# Altium project Power Board.PrjPcb
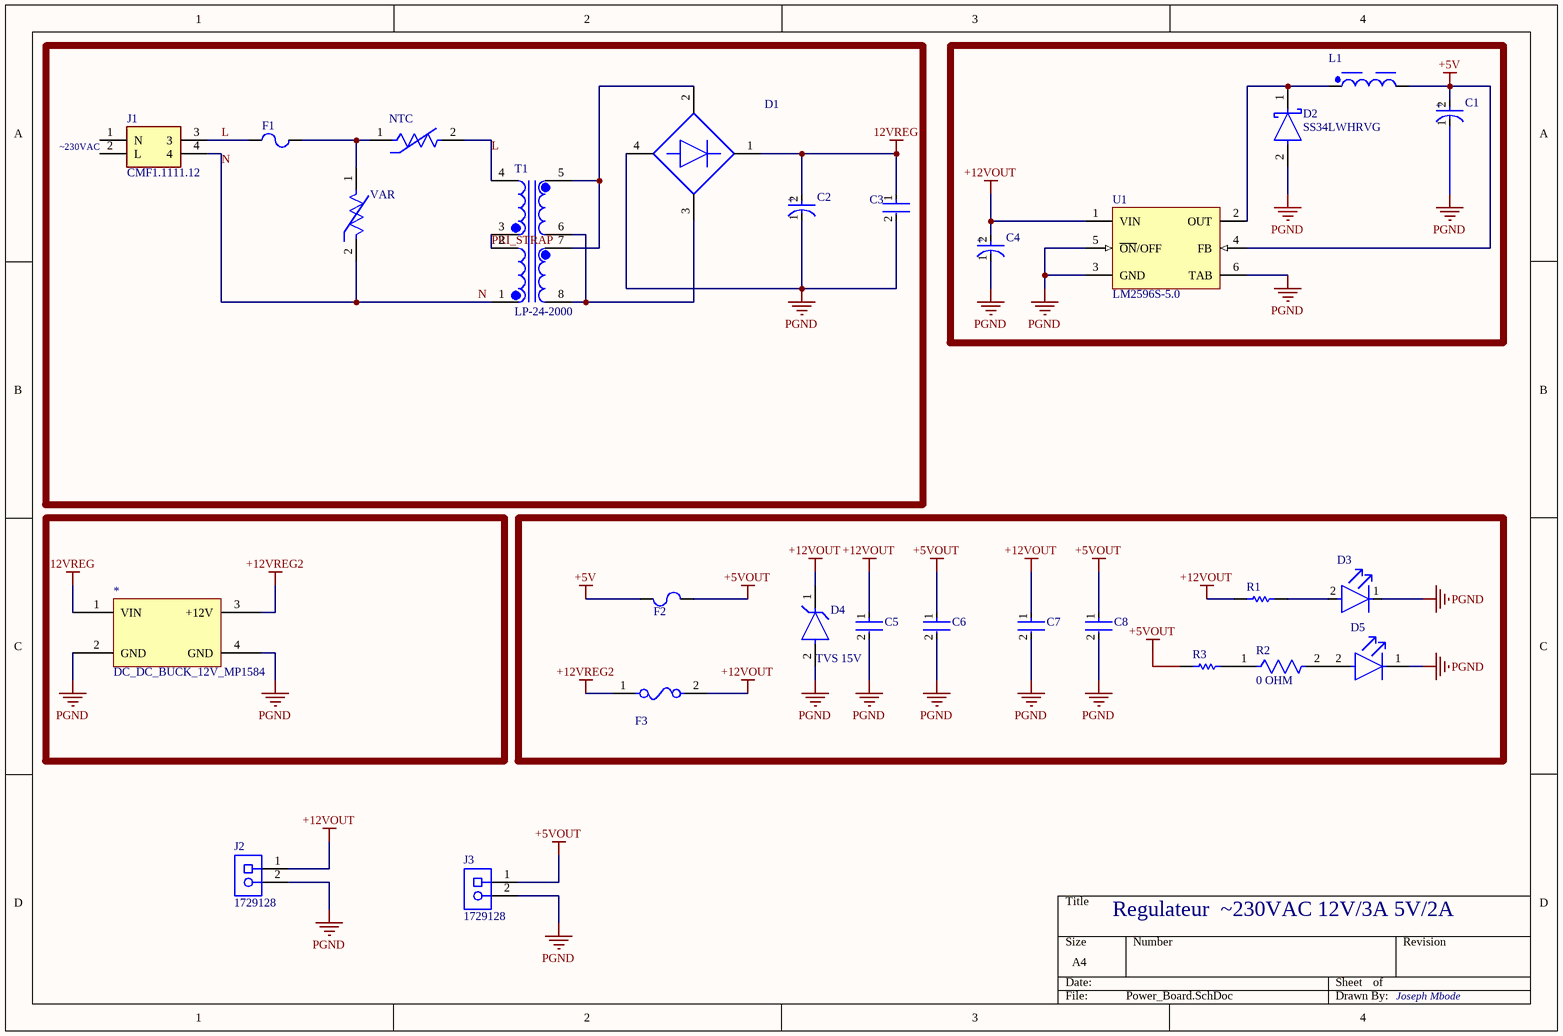
[diagram p0: Power_Board.SchDoc]
1 sheet, 28 parts. Net scope: global (net labels, ports and power ports of the same name join across sheets).
Board file: Power_Board.PcbDoc

## Sheet Power_Board.SchDoc
size A4; SheetNumber: 1; SheetTotal: 1

### Parts
*  DC_DC_BUCK_12V_MP1584  [DC_DC_BUCK_12V_MP1584]
C1  EEVTG1H221Q  [FP-TGH13-MFG]  (value not drawn)
C2  ECA1VHG472  [FP-RAD-TH-D_18_0_5-L_35_5-MFG]  (value not drawn)
C3  RHEL81H155K2A2H03B  [FP-RHE2DB-MFG]  (value not drawn)
C4  EEUFR1E221  [FP-RAD-TH-D_8_0_5-L_11_5-MFG]  (value not drawn)
C5  AC1206KKX7R0BB104  [FP-AC1206-0_85-MFG]  (value not drawn)
C6  AC1206KKX7R0BB104  [FP-AC1206-0_85-MFG]  (value not drawn)
C7  AC1206KKX7R0BB104  [FP-AC1206-0_85-MFG]  (value not drawn)
C8  AC1206KKX7R0BB104  [FP-AC1206-0_85-MFG]  (value not drawn)
D1  GBU4M-E3/51  [FP-GBU4M-E3-51-MFG]  (value not drawn)
D2  SS34LWHRVG  [FP-SS34LWH-MFG]
D3  XLUR12D  [FP-XLUR12D-MFG]  (value not drawn)
D4  TVS 15V  [FP-DO-15-MFG]
D5  SSL-LX5093YD  [FP-SSL-LX5093YD-MFG]  (value not drawn)
F1  021502.5MXP  [LFUS-0215-20X5_L]  (value not drawn)
F2  1812L150ZR  [LFUS-FUSE1812-71_V]  (value not drawn)
F3  0452004.MRL  [FP-0452-MFG]  (value not drawn)
J1  CMF1.1111.12  [CMF1111112]
J2  1729128  [PHOE-1729128-2_V]
J3  1729128  [PHOE-1729128-2_V]
L1  7447471330  [WE-TIS_1111]  (value not drawn)
NTC  NTPAA100LDNB0  [FP-NTPAA-MFG]  (value not drawn)
R1  3R3 5% 0805(2012)  [RESC0805(2012)_M]  (value not drawn)
R2  0 OHM  [FP-CRG0402-IPC_C]
R3  3R3 5% 0805(2012)  [RESC0805(2012)_M]  (value not drawn)
T1  LP-24-2000  [XFMR_LP-24-2000]
U1  LM2596S-5.0  [KTT0005B_L]
VAR  IsoM5-275-B-L2  [FP-IsoM5-275-B-L2-MFG]  (value not drawn)

### Blocks framed on the sheet
~230VAC: C2 C3 D1 F1 J1 NTC T1 VAR

### Nets
12VREG: *.1(VIN) C2.2(A) C3.1 D1.1(+)
+5V: C1.2(A) F2.1 L1.2 U1.4(FB)
+5VOUT: C6.1 C8.1 F2.2 J3.1 R3.1
+12VOUT: C4.2(A) C5.1 C7.1 D4.1(C) F3.2 J2.1 R1.1 U1.1(VIN)
+12VREG2: *.3(+12V) F3.1
PGND: *.2(GND) *.4(GND) C1.1(C) C2.1(C) C3.2 C4.1(C) C5.2 C6.2 C7.2 C8.2 D1.4(-) D2.2(A) D3.1(C) D4.2(A) D5.1(C) J2.2 J3.2 U1.3(GND) U1.5(~{ON}/OFF) U1.6(TAB)
L: F1.1 J1.3 NTC.2 T1.4
N: J1.4 T1.1 VAR.2
PRI_STRAP: T1.2 T1.3
NetD1_2: D1.2(1_~) T1.5 T1.7
NetD1_3: D1.3(2_~) T1.6 T1.8
NetD2_1: D2.1(C) L1.1 U1.2(OUT)
NetD3_2: D3.2(A) R1.2
NetD5_2: D5.2(A) R2.2
NetF1_2: F1.2 NTC.1 VAR.1
NetR2_1: R2.1 R3.2

Not connected (* = marked no-connect by the designer): J1 1(N) 2(L)

### Notes on the sheet
- Regulateur  ~230VAC 12V/3A 5V/2A
- Joseph Mbode
- (in symbol CMP-05427-000003-1) +
- (in symbol CMP-05427-000847-1) +
- (in symbol CMP-05427-001627-1) +

### Library data of the parts
C1 = CMP-05427-000003-1: CAP ALUM 220UF 20% 50V SMD; Manufacturer: Panasonic Electronic Components; Life: 1000Hours; Material: Aluminum; Esr: 0.23Ω; Ripple Current: 600mA; Leakage Current: 1.1mA; Dissipation Factor: 14%; Automotive Grade: Grade 1; RoHS: TRUE; Digikey Description: CAP ALUM 220UF 20% 50V SMD; Package: TGH13; ComponentLink2URL: https://industrial.panasonic.com/cdbs/www-data/pdf/RDE0000/ABA0000C1187.pdf; Height: 14mm; Temperature: -40°C to +125°C; Tolerance: 20%; Temperature Range High: +125°C; Capacitance: 220uF; Temperature Range Low: -40°C; Device Class L1: Passive Components; Voltage Rating: 50V; Device Class L2: Capacitors; Category: Cap; Value: 220uF; Manufacturer Part Number: EEVTG1H221Q; Footprint Url: https://industrial.panasonic.com/cdbs/www-data/pdf/RDE0000/DME0000COL48.pdf; Octopart: https://octopart.com/eev-tg1h221q-panasonic-39480853; ComponentLink2Description: Datasheet; Automotive: Yes; Device Class L3: Aluminum Electrolytic Capacitors; Mouser Description: Aluminum Electrolytic Capacitors - SMD 220UF 50V TG SMD; Lead Free: Yes
C2 = CMP-05427-001627-1: Aluminum Electrolytic Capacitors (Radial Lead Type) AEC-Q200 Qualified 4700uF ±20% 35V; Leakage Current: 3uA; Life (Hours): 2000Hour; Lead Diameter: 0.8mm; Dissipation Factor: 0.2%; Lead/Base Style: Straight; Ripple Current: 1.91A; Capacitance: 4.7mF; Packaging: Bulk; RoHS Compliant: Yes; Number of Pins: 2; Radiation Hardening: No; Features: General Purpose; Mount: Through Hole; Voltage Rating (DC): 35V; Construction: RADIAL; Min Operating Temperature: -55°C; Voltage Rating: 35V; Contact Plating: Tin; Height - Seated (Max): 1.398inch; Termination: Radial; Series: NHG; Lead Pitch: 7.5mm; Diameter: 18mm; Voltage: 35V; Package Quantity: 50; Height: 35.5mm; Max Operating Temperature: 105°C; REACH SVHC: No SVHC; Length: 35.5mm; Case/Package: Radial; Tolerance: 20%; Ripple Current (AC): 1.91A
C3 = CMP-06035-050647-1: Ceramic Capacitor Automotive 1.5uF ±10% 50V X8L Radial; Tolerance: 10%; REACH SVHC: No SVHC; Min Operating Temperature: -55°C; Max Operating Temperature: 150°C; Voltage Rating (DC): 50V; Dielectric: X8L; Lead Pitch: 2.5mm; Voltage Rating: 50V; Capacitance: 1.5uF
C4 = CMP-05427-000847-1: Aluminum Electrolytic Capacitors (Radial Lead Type) 220uF ±20% 25V; Impedance: 56mR; Ripple Current (AC): 950mA; Lead Diameter: 0.6mm; Life (Hours): 6000Hour; Max Operating Temperature: 105°C; Height: 11.5mm; Min Operating Temperature: -40°C; Series: FR Radial; Voltage Rating (DC): 25V; RoHS Compliant: Yes; Voltage Rating: 25V; Diameter: 8mm; Ripple Current: 950mA; Contact Plating: Tin; Case/Package: Radial; Lead Pitch: 3.5mm; Termination: Radial; Capacitance: 220uF; Construction: RADIAL; Voltage: 25V; Tolerance: 20%; REACH SVHC: Yes; Mount: Through Hole
C5-C8 = CMP-03422-001145-1: CAP CER 0.1UF 100V X7R 1206; Manufacturer: Yageo; Material: Ceramic; Temperature Coefficient: 15%; Tolerance: 0.1; Automotive Grade: Grade 1; Value: 100 nF; Category: Cap; Temperature Characteristic: X7R; Height: 0.95mm; Automotive: Yes; Digikey Description: CAP CER 0.1UF 100V X7R 1206; Voltage Rating: 100 V; Octopart: https://octopart.com/ac1206kkx7r0bb104-yageo-75666120; ComponentLink2URL: http://www.yageo.com/documents/recent/UPY-AC_NP0X7R_16V-to-630V_12.pdf; Device Class L1: Passive Components; ComponentLink2Description: Datasheet; Footprint Url: http://www.yageo.com/exep/pages/download/literatures/UPY-C_GEN_24.pdf; Lead Free: Yes; Ipc Land Pattern Name: CAPC320160X85; Device Class L3: Ceramic Capacitors; Manufacturer Part Number: AC1206KKX7R0BB104; Device Class L2: Capacitors; Capacitance: 100 nF; RoHS: TRUE; Temperature Range Low: -55°C; Temperature: -55°C to +125°C; Temperature Range High: +125°C; Package: AC1206-0.85
D1 = CMP-13193-000001-1: BRIDGE RECT 1PHASE 1KV 3A GBU; Forward Voltage: 1V; Peak Non-Repetitive Surge Current: 150A; Number of Elements: 1; Element Configuration: Single; Max Reverse Current: 5uA; Forward Current: 4A; Width: 3.56mm; Max Repetitive Reverse Voltage (Vrrm): 1kV; Series: -; Min Operating Temperature: -55°C; Max Operating Temperature: 150°C; Max Forward Surge Current (Ifsm): 150A; Package Quantity: 250; Packaging: Bulk; Average Rectified Current: 3A; Height: 18.8mm; Mount: Through Hole; Max Reverse Leakage Current: 5uA; RoHS Compliant: Yes; Max Surge Current: 150A; Lead Free: Lead Free; Length: 22.3mm; Case/Package: SIP; Radiation Hardening: No; Number of Pins: 4
D2 = CMP-15604-000001-1: DIODE SCHOTTKY 40V 3A SOD123W; RoHS Compliant: Yes
D3 = CMP-02085-08376351-1: 627nm Red LED; 5x8.6mm, Through-Hole Mount with Red Diffused Round Lamp; Test Current: 10mA; Viewing Angle: 30°; Dominant Wavelength: 617nm; Luminous Intensity: 39mcd; Forward Voltage: 1.9V; Wavelength: 627nm; Case/Package: Radial; Lens Color: Red; Mount: Through Hole; Height: 8.6mm; Color: Red; Lifecycle Status: Production; Lens Transparency: Diffused; RoHS: Compliant
D4 = CMP-00278-00112159-1: P6KE15A 600 Watt SUR40 Transient Voltage Suppressor, 15 V, Unidirectional; NexarPartId: 112159; Element Configuration: Single; Number of Channels: 1; Power Rating: 600W; Power Line Protection: No; Max Surge Current: 28A; Clamping Voltage: 21.2V; Capacitance: 1.6pF; Max Breakdown Voltage: 15.8V; Breakdown Voltage: 14.3V; Reverse Standoff Voltage: 12.8V; Leakage Current: 5µA; Test Current: 1mA; Max Operating Temperature: 150°C; Packaging: Bulk; Case/Package: DO-15; Mount: Through Hole; Number of Elements: 1; Max Power Dissipation: 600W; Radiation Hardening: No; Diameter: 3.56mm; Peak Pulse Current: 28A; Peak Pulse Power: 600W; Length: 6.75mm; Lead Free: Lead Free; Min Operating Temperature: -55°C; Polarity: Unidirectional; Composition: Zener; Current Rating: 28A; Termination: Axial; ESD Protection: No; Height: 3.56mm; REACH SVHC: No SVHC; Weight: 300mg; RoHS: Compliant; Number of Unidirectional Channels: 1; Number of Pins: 2; Operating Supply Voltage: 12.8V; Min Breakdown Voltage: 14.3V; Direction: Unidirectional; Voltage Rating (DC): 15V; Max Reverse Leakage Current: 5µA; Reverse Breakdown Voltage: 14.3V; Power Dissipation: 600W; Width: 3.56mm
D5 = CMP-57192-000007-1: LED YELLOW DIFFUSED T-1 3/4 T/H; Test Current: 20mA; Number of LEDs: 1; Dominant Wavelength: 568nm; Wavelength: 585nm; Forward Voltage: 2.1V; Lens Style: Dome; Viewing Angle: 60°; Luminous Intensity: 30mcd; Min Operating Temperature: -40°C; Packaging: Bulk; Width: 1.5inch; Lead Free: Lead Free; Number of Pins: 2; Color: Yellow; Case/Package: Radial; Forward Current: 20mA; REACH SVHC: No SVHC; Lens Transparency: Diffused; Weight: 0.01lb; Height: 8.6mm; Package Quantity: 1000; Series: -; Length: 0.5inch; Illumination Color: Yellow; Mount: Through Hole; Diameter: 5mm; RoHS Compliant: Yes; Lens Color: Yellow; Max Operating Temperature: 85°C
F1 = CMP-2000-05620-1: Time-Lag Type Cartridge Fuse, 2.5 A, 0.00386 Ohm, 250 V, -55 to 125 degC, 2-Pin SMD, RoHS, Bulk; Manufacturer: Littelfuse; Working Voltage-Max: 250V; Response Characteristic: TimeLag; Current Rating: 2.5A; Datasheet Version: 05/2016; Datasheet URL: http://www.littelfuse.com/~/media/electronics/datasheets/fuses/littelfuse_fuse_215_datasheet.pdf.pdf; Package Description: 2-Pin Surface Mount Device, Body 20 x 5.15 mm; Package Reference: 0215-20X5; Operating Temp Range: -55to+125°C; Size: 5x20mm; Manufacturer URL: http://www.littelfuse.com/; Mounting Technology: SurfaceMount
F2 = CMP-0257-00001-1: Resettable PTC, 1812, 1.5 A Ihold, 3.0 A Itrip; Itrip: 3 A; Vmax: 8 Vdc; Ihold: 1.5 A; Imax: 100 A; PackageReference: FUSE1812-71; ComponentLink1Description: Manufacturer URL; DatasheetVersion: 6/2012; ComponentLink2URL: http://www.littelfuse.com/products/resettable-ptcs/surface-mount/1812l/~/media/Electronics_Technical/Datasheets/Resettable_PTCs/Littelfuse_PTC_1812L_Datasheet.pdf; PackageVersion: 6/2012; PackageDescription: 2-Pin SMT Fuse, 4.55 x 3.24 mm Body; ComponentLink1URL: http://www.littelfuse.com/; PartNumber: 1812L150ZR; ComponentLink2Description: Datasheet
F3 = CMP-08605-000077-1: FUSE BRD MNT 4A 125VAC/VDC 2SMD; Manufacturer: Littelfuse Inc; Max Fuse Dc Voltage: 125V; Fuse I2T: 34.4A2Sec; Fuse Interrupt Ac Current: 50A; Description: 4A 125V AC 125V DC Fuse Board Mount (Cartridge Style Excluded) Surface Mount 2-SMD, Square End Block; Fuse Interrupt Dc Current: 300A; Fuse Blow Speed: Slow; Value: 0.0186Ω; Digikey Description: FUSE BRD MNT 4A 125VAC/VDC 2SMD; Voltage Rating: 125V; Height: 2.94mm; Device Class L2: Fuses; Lead Free: Yes; Manufacturer Part Number: 0452004.MRL; Automotive: No; Fuse Current: 4A; Device Class L3: unset; RoHS: TRUE; Max Fuse Ac Voltage: 125V; Temperature Range Low: -55°C; Category: Fuse; Device Class L1: Circuit Protection; ComponentLink2Description: Datasheet; Temperature: -55°C to +125°C; ComponentLink2URL: https://www.littelfuse.com/~/media/electronics/datasheets/fuses/littelfuse_fuse_452_454_datasheet.pdf.pdf; Temperature Range High: +125°C; Octopart: https://octopart.com/0452004.mrl-littelfuse-566421; Mouser Description: Surface Mount Fuses 125V 4A; Resistance: 0.0186Ω; Package: 0452
J1 = CMF1.1111.12: CAD-model shows appliance inlet with PCB-terminals only, with line switch marking 0/1, snap-in mounting on PCB and fixation with screw to the centre position from the top, with rear-side insulation cover.; Manufacturer_Name: SCHURTER; Geometry.Height: 18mm; Manufacturer_Part_Number: CMF1.1111.12; Mouser Part Number: 693-CMF1.1111.12; Mouser Price/Stock: https://www.mouser.co.uk/ProductDetail/Schurter/CMF1111112?qs=%2F0Eb3QIYuIbNncoXboECMA%3D%3D; Arrow Part Number: *; Arrow Price/Stock: *; Datasheet Link: https://www.schurter.com/en/datasheet/typ_CMF1.pdf
J2 J3 = CMP-2000-05815-1: PCB Terminal Block, 13.5 A, 400 V, 2-Pin THD, RoHS, Bulk; Manufacturer: Phoenix Contact; Package Version: 03/2015; No. of Rows: 1; Pitch: 5.08mm; No. of Positions: 2; Voltage Rating: 400V; Current Rating: 13500mA; Manufacturer URL: http://www.phoenixcontact.com/; Datasheet URL: https://datasheet.ciiva.com/16046/1729128-16046181.pdf; RoHS: TRUE; Package URL: https://www.phoenixcontact.com/online/portal/pi/pxc/product_detail_page/!ut/p/b1/3VdJjqNKFDxLH8AFycySyWY2ozFsEPOMMQaDOX1XedGL_1Vdm5YXJleknhSKeBkvI6EA8ncAo3AYoDhBQGco6KN7VURTdemj9us_IEKEZo_YHiPAEWEFmDGOHMORkqKYCORBZxgL7ZoaZYcbFFUZ3fqxSY6GOuxydWUuHqz1ynmMFygu583Bob0Ewr6Sd_l-5m-kAueHiB0jpRwZwe58wwtkpxtMYd_LmGcDRU02dRNEyWt6Y2ti5pSyJ_reIkzIulrqApdnbT11V5jnCKbYNCvhEM1MCpPByat_X379-iThf08CI5GfOPqfBeS3BRoBOdD55AKVv0iLwCMq-2BrzXWSGRH7pUGD9uwXQjiph3xL0DKQwdGa0JImiIOmBNOestqgwTHSSs2oOep-78apyXQBvNi8ZLaFjvjWvcaUEBu0MC6Wbe-d6mB0FAebo2lUWinqYaZs5DAYzV0RP9yitUjnGJ0iI9xhZkT42OCQNUJJhkgWINNQLP2JFP6OpMg3JCVg70jqHT0lvKOnhHf0lPuOnnLf0VPuWx6_dxwUIvwk5WMkT0kLL1mh61l2yZVSzG3pYV_bqo-mj6uMKwKwdnnW8Jh5RTOJzMOA5c-eJDaZQw4mTMPH02PvS_ZAqNVjVTo2WyYLkwH_KU1mmmG5kjRhDqPXLwwVHvVOjCM60-fpXvTDfMGW1PVFVS1r4e4yVDk4ZdNbkUHvqPqQSeian4UD39fNKmachqdJ1NJbyk8rXT9mXTvPk3oE5meulKGgiruPJek-4I9hTT6G8ZLOyRSm2RRVbThERQad5OS28hdt4YW4vG0stgYYzsWsK4_7y6DZMjJSCqri1kyiZR5vD7pwIrNR7QwPHTcLTI5qT7eRlpHrdGiupYlqQDJ7zy_CND8fWWBoLRXxk1RVcXiBQwbTD4Xi7KL-FuO94t9xaqweXzH; PartNumber: 1729128; Package Description: 2-Pin Through Hole Device, Body 8.1 x 10.16 mm, Pitch 5.08 mm; Datasheet Version: 12/2013; Mounting Technology: ThroughHole; Orientation: Horizontal; Package Reference: 1729128-2; Packing: Bulk
L1 = CMP-1406-00003-3: Inductor Power Shielded Wirewound 33uH 20% 1KHz Ferrite 3.6A 61mOhm DCR RDL Tray; Self Resonant Frequency: 10MHz; Inductance: 33µH; Saturation Current: 2.8A; Current Rating: 3A; DC Resistance (DCR): 57mΩ; Series Resistance: 50mΩ; Lead Diameter: 650µm; Height: 11.5mm; Lead Pitch: 5mm; Features: Shielded; Min Operating Temperature: -40°C; Ambient Temperature Range Low: -40°C; Frequency: 10MHz; Ambient Temperature Range High: 85°C; RMS Current (Irms): 3.6A; Inductance Tolerance: 20%; Mount: Radial, Through Hole; Length: 11mm; Core Material: Ferrite; REACH SVHC: Unknown; Max Operating Temperature: 125°C; Max DC Current: 3.6A; Shielding: Shielded; Case/Package: Radial; Tolerance: 20%; Width: 11mm; Diameter: 11mm; Test Frequency: 1kHz; RoHS: Compliant; Number of Pins: 2
NTC = CMP-06022-000465-1: ICL 10 OHM 15% 1.7A 10MM; Mount: Through Hole; Lead Free: Lead Free; Tolerance: 15%; Lead Pitch: 0.295inch; Max Operating Temperature: 160°C; Radiation Hardening: No; Diameter: 0.394inch; Current Rating: 1.7A; Min Operating Temperature: -20°C; Packaging: Bulk; Number of Pins: 2; Depth: 5mm; Thickness: 5mm
R1 R3 = CMP-1013-00014-1: 3R3 0.125W 5% 0805 (2012 Metric)  SMD; Case-Metric: 2012; Case-EIA: 0805; Value: 3.30 Ohm; Technology: SMT; Tolerance: 5 %; Power: 0.125 W
R2 = CMP-03211-011400-1: RES SMD 0 OHM JUMPER 1/16W 0402; Number of Resistors: 1; Tolerance: 0%; Voltage Rating: 50V; Insulation Resistance: 1GR; Power Rating: 63mW; Temperature Coefficient: 200ppm/°C; Resistance: 0mR; Weight: 2.3E-05oz; Number of Terminations: 2; Technology: THICK FILM; Resistor Type: Thick Film; Mount: Surface Mount; Termination: Solder; Number of Pins: 2; RoHS Compliant: Yes; Packaging: Tape and Reel; Depth: 0.5mm; Case Code (Metric): 1005; Min Operating Temperature: -55°C; Series: CRG; Height: 0.35mm; Voltage Rating (DC): 50V; Case Code (Imperial): 0402; Max Operating Temperature: 125°C; ELV: Compliant; Case/Package: 0402; Length: 1mm; Radiation Hardening: No; Width: 0.5mm; Package Quantity: 10000
T1 = LP-24-2000: Flat Head Low Profile Transformer | 48VA Power | 115V/230V Input | 24VCT Output Series | 12V Output Parallel; MF: Signal Transformer; SnapEDA_Link: https://www.snapeda.com/parts/LP-24-2000/Signal+Transformer/view-part/?ref=snap; Package: None; Value: *; MP: LP-24-2000; Check_prices: https://www.snapeda.com/parts/LP-24-2000/Signal+Transformer/view-part/?ref=eda
U1 = CMP-0069-00270-3: SIMPLE SWITCHER® Power Converter 150 KHz 3A Step-Down Voltage Regulator, 5-pin TO-263; Manufacturer: Texas Instruments; PowerWise: N; PackageTopMarking: NSUZXYTTE#*LM2596S*-5.0 P+; RoHS: N; Code_JEDEC: MO-169-AB; PackageDescription: TO-263, Molded, .400 x .390 x .180in, 5 Lead, .067in Pitch, Surface Mount; PinCount: 5; PackageReference: KTT0005B; CompType: Switcher; ComponentLink1URL: http://www.ti.com/general/docs/lit/getliterature.tsp?genericPartNumber=LM2596&fileType=pdf; ComponentLink1Description: Datasheet URL
VAR = CMP-07402-000023-1: ISOMOV 5KA 275VRMS BULK IN-LINE